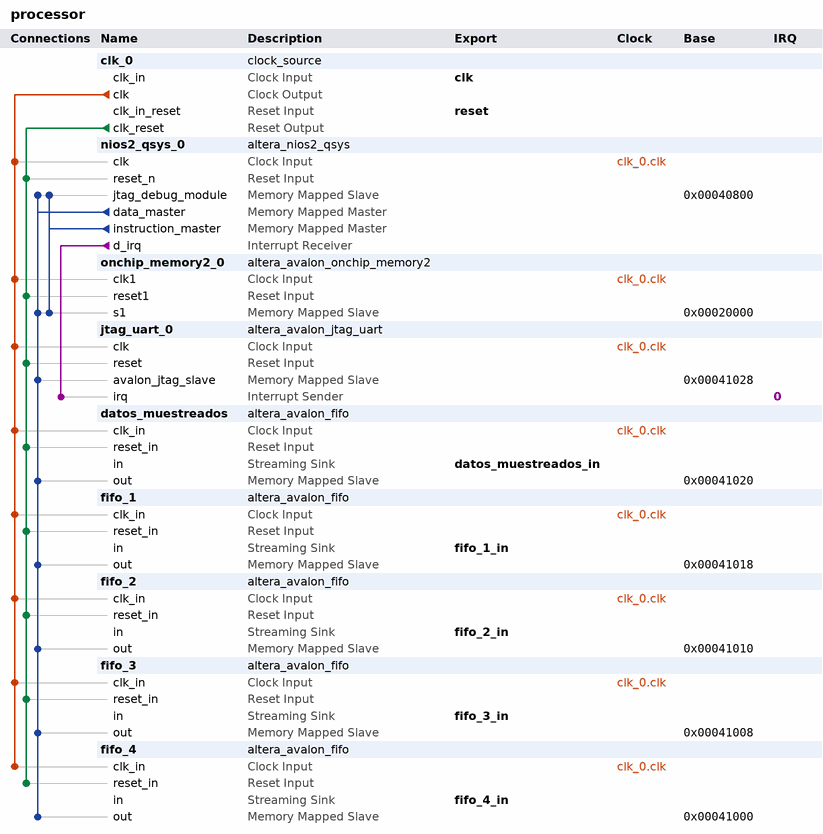
[diagram p0: system contents]
# Platform Designer (Qsys) system processor, MAX 10 10M50DAF484C7G
# Parameters at their usual value, and those the tool derives, are not listed.
package require -exact qsys 17.1
create_system processor
set_project_property DEVICE_FAMILY {MAX 10}
set_project_property DEVICE 10M50DAF484C7G

add_instance clk_0 clock_source 17.1
set_instance_parameter_value clk_0 clockFrequency 50000000

add_instance nios2_qsys_0 altera_nios2_qsys 16.1
set_instance_parameter_value nios2_qsys_0 breakSlave nios2_qsys_0.jtag_debug_module
set_instance_parameter_value nios2_qsys_0 exceptionSlave onchip_memory2_0.s1
set_instance_parameter_value nios2_qsys_0 icache_size 4096
set_instance_parameter_value nios2_qsys_0 impl Tiny
set_instance_parameter_value nios2_qsys_0 mmu_TLBMissExcSlave None
set_instance_parameter_value nios2_qsys_0 muldiv_multiplierType DSPBlock
set_instance_parameter_value nios2_qsys_0 resetSlave onchip_memory2_0.s1
set_instance_parameter_value nios2_qsys_0 resetrequest_enabled true

add_instance onchip_memory2_0 altera_avalon_onchip_memory2 17.1
set_instance_parameter_value onchip_memory2_0 dataWidth 32
set_instance_parameter_value onchip_memory2_0 dualPort false
set_instance_parameter_value onchip_memory2_0 initMemContent false
set_instance_parameter_value onchip_memory2_0 initializationFileName onchip_mem.hex
set_instance_parameter_value onchip_memory2_0 memorySize 131072

add_instance jtag_uart_0 altera_avalon_jtag_uart 17.1
set_instance_parameter_value jtag_uart_0 simInteractiveOptions NO_INTERACTIVE_WINDOWS

add_instance datos_muestreados altera_avalon_fifo 17.1
set_instance_parameter_value datos_muestreados bitsPerSymbol 32
set_instance_parameter_value datos_muestreados channelWidth 0
set_instance_parameter_value datos_muestreados errorWidth 0
set_instance_parameter_value datos_muestreados fifoDepth 1024
set_instance_parameter_value datos_muestreados fifoInputInterfaceOptions AVALONST_SINK
set_instance_parameter_value datos_muestreados fifoOutputInterfaceOptions AVALONMM_READ
set_instance_parameter_value datos_muestreados singleClockMode true
set_instance_parameter_value datos_muestreados symbolsPerBeat 1
set_instance_parameter_value datos_muestreados useIRQ true
set_instance_parameter_value datos_muestreados usePacket false
set_instance_parameter_value datos_muestreados useReadControl false
set_instance_parameter_value datos_muestreados useWriteControl false

add_instance fifo_1 altera_avalon_fifo 17.1
set_instance_parameter_value fifo_1 bitsPerSymbol 32
set_instance_parameter_value fifo_1 channelWidth 0
set_instance_parameter_value fifo_1 errorWidth 0
set_instance_parameter_value fifo_1 fifoDepth 1024
set_instance_parameter_value fifo_1 fifoInputInterfaceOptions AVALONST_SINK
set_instance_parameter_value fifo_1 fifoOutputInterfaceOptions AVALONMM_READ
set_instance_parameter_value fifo_1 singleClockMode true
set_instance_parameter_value fifo_1 symbolsPerBeat 1
set_instance_parameter_value fifo_1 useIRQ true
set_instance_parameter_value fifo_1 usePacket false
set_instance_parameter_value fifo_1 useReadControl false
set_instance_parameter_value fifo_1 useWriteControl false

add_instance fifo_2 altera_avalon_fifo 17.1
set_instance_parameter_value fifo_2 bitsPerSymbol 32
set_instance_parameter_value fifo_2 channelWidth 0
set_instance_parameter_value fifo_2 errorWidth 0
set_instance_parameter_value fifo_2 fifoDepth 1024
set_instance_parameter_value fifo_2 fifoInputInterfaceOptions AVALONST_SINK
set_instance_parameter_value fifo_2 fifoOutputInterfaceOptions AVALONMM_READ
set_instance_parameter_value fifo_2 singleClockMode true
set_instance_parameter_value fifo_2 symbolsPerBeat 1
set_instance_parameter_value fifo_2 useIRQ true
set_instance_parameter_value fifo_2 usePacket false
set_instance_parameter_value fifo_2 useReadControl false
set_instance_parameter_value fifo_2 useWriteControl false

add_instance fifo_3 altera_avalon_fifo 17.1
set_instance_parameter_value fifo_3 bitsPerSymbol 32
set_instance_parameter_value fifo_3 channelWidth 0
set_instance_parameter_value fifo_3 errorWidth 0
set_instance_parameter_value fifo_3 fifoDepth 1024
set_instance_parameter_value fifo_3 fifoInputInterfaceOptions AVALONST_SINK
set_instance_parameter_value fifo_3 fifoOutputInterfaceOptions AVALONMM_READ
set_instance_parameter_value fifo_3 singleClockMode true
set_instance_parameter_value fifo_3 symbolsPerBeat 1
set_instance_parameter_value fifo_3 useIRQ true
set_instance_parameter_value fifo_3 usePacket false
set_instance_parameter_value fifo_3 useReadControl false
set_instance_parameter_value fifo_3 useWriteControl false

add_instance fifo_4 altera_avalon_fifo 17.1
set_instance_parameter_value fifo_4 bitsPerSymbol 32
set_instance_parameter_value fifo_4 channelWidth 0
set_instance_parameter_value fifo_4 errorWidth 0
set_instance_parameter_value fifo_4 fifoDepth 1024
set_instance_parameter_value fifo_4 fifoInputInterfaceOptions AVALONST_SINK
set_instance_parameter_value fifo_4 fifoOutputInterfaceOptions AVALONMM_READ
set_instance_parameter_value fifo_4 singleClockMode true
set_instance_parameter_value fifo_4 symbolsPerBeat 1
set_instance_parameter_value fifo_4 useIRQ true
set_instance_parameter_value fifo_4 usePacket false
set_instance_parameter_value fifo_4 useReadControl false
set_instance_parameter_value fifo_4 useWriteControl false

# connections
add_connection clk_0.clk datos_muestreados.clk_in clock
add_connection clk_0.clk fifo_1.clk_in clock
add_connection clk_0.clk fifo_2.clk_in clock
add_connection clk_0.clk fifo_3.clk_in clock
add_connection clk_0.clk fifo_4.clk_in clock
add_connection clk_0.clk jtag_uart_0.clk clock
add_connection clk_0.clk nios2_qsys_0.clk clock
add_connection clk_0.clk onchip_memory2_0.clk1 clock
add_connection clk_0.clk_reset datos_muestreados.reset_in reset
add_connection clk_0.clk_reset fifo_1.reset_in reset
add_connection clk_0.clk_reset fifo_2.reset_in reset
add_connection clk_0.clk_reset fifo_3.reset_in reset
add_connection clk_0.clk_reset fifo_4.reset_in reset
add_connection clk_0.clk_reset jtag_uart_0.reset reset
add_connection clk_0.clk_reset nios2_qsys_0.reset_n reset
add_connection clk_0.clk_reset onchip_memory2_0.reset1 reset
add_connection nios2_qsys_0.data_master datos_muestreados.out avalon
set_connection_parameter_value nios2_qsys_0.data_master/datos_muestreados.out baseAddress 0x00041020
add_connection nios2_qsys_0.data_master fifo_1.out avalon
set_connection_parameter_value nios2_qsys_0.data_master/fifo_1.out baseAddress 0x00041018
add_connection nios2_qsys_0.data_master fifo_2.out avalon
set_connection_parameter_value nios2_qsys_0.data_master/fifo_2.out baseAddress 0x00041010
add_connection nios2_qsys_0.data_master fifo_3.out avalon
set_connection_parameter_value nios2_qsys_0.data_master/fifo_3.out baseAddress 0x00041008
add_connection nios2_qsys_0.data_master fifo_4.out avalon
set_connection_parameter_value nios2_qsys_0.data_master/fifo_4.out baseAddress 0x00041000
add_connection nios2_qsys_0.data_master jtag_uart_0.avalon_jtag_slave avalon
set_connection_parameter_value nios2_qsys_0.data_master/jtag_uart_0.avalon_jtag_slave baseAddress 0x00041028
add_connection nios2_qsys_0.data_master nios2_qsys_0.jtag_debug_module avalon
set_connection_parameter_value nios2_qsys_0.data_master/nios2_qsys_0.jtag_debug_module baseAddress 0x00040800
add_connection nios2_qsys_0.data_master onchip_memory2_0.s1 avalon
set_connection_parameter_value nios2_qsys_0.data_master/onchip_memory2_0.s1 baseAddress 0x00020000
add_connection nios2_qsys_0.instruction_master nios2_qsys_0.jtag_debug_module avalon
set_connection_parameter_value nios2_qsys_0.instruction_master/nios2_qsys_0.jtag_debug_module baseAddress 0x00040800
add_connection nios2_qsys_0.instruction_master onchip_memory2_0.s1 avalon
set_connection_parameter_value nios2_qsys_0.instruction_master/onchip_memory2_0.s1 baseAddress 0x00020000
add_connection nios2_qsys_0.d_irq jtag_uart_0.irq interrupt
set_connection_parameter_value nios2_qsys_0.d_irq/jtag_uart_0.irq irqNumber 0

# exported interfaces
add_interface clk clock sink
set_interface_property clk EXPORT_OF clk_0.clk_in
add_interface datos_muestreados_in avalon_streaming sink
set_interface_property datos_muestreados_in EXPORT_OF datos_muestreados.in
add_interface fifo_1_in avalon_streaming sink
set_interface_property fifo_1_in EXPORT_OF fifo_1.in
add_interface fifo_2_in avalon_streaming sink
set_interface_property fifo_2_in EXPORT_OF fifo_2.in
add_interface fifo_3_in avalon_streaming sink
set_interface_property fifo_3_in EXPORT_OF fifo_3.in
add_interface fifo_4_in avalon_streaming sink
set_interface_property fifo_4_in EXPORT_OF fifo_4.in
add_interface reset reset sink
set_interface_property reset EXPORT_OF clk_0.clk_in_reset

set_interconnect_requirement {$system} qsys_mm.clockCrossingAdapter HANDSHAKE
set_interconnect_requirement {$system} qsys_mm.enableEccProtection FALSE
set_interconnect_requirement {$system} qsys_mm.insertDefaultSlave FALSE
set_interconnect_requirement {$system} qsys_mm.maxAdditionalLatency 1

save_system processor.qsys
